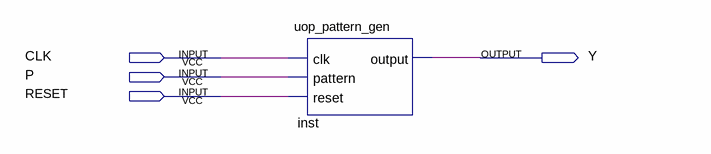
[diagram p0: schematic sheet]
// Quartus schematic behavioural.bdf as structural Verilog: 1 symbols, 4 pins
module behavioural (
  input  CLK,
  input  P,
  input  RESET,
  output Y
);

  uop_pattern_gen inst (.clk(CLK), .pattern(P), .reset(RESET), .\output (Y));
endmodule
